# Altium schematic sheet DroneRegul.SchDoc
size A4
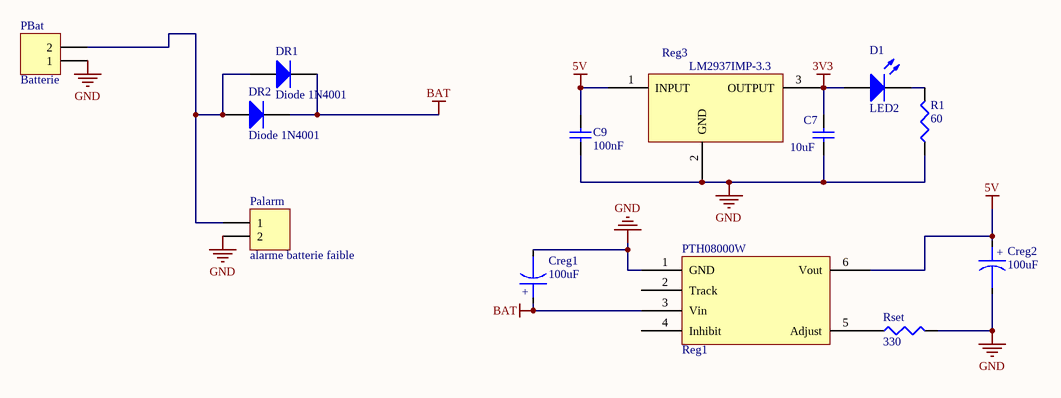
[diagram p0: DroneRegul.SchDoc]

## Parts
C7  value 10uF  [C0805C]  (hidden comment: CAP)
C9  value 100nF  [C0805C]  (hidden comment: CAP)
Creg1  value 100uF  [RB.1/.3]  (hidden comment: CAP Pol)
Creg2  value 100uF  [RB.1/.3]  (hidden comment: CAP Pol)
D1  LED2  [LED1206G]
DR1  Diode 1N4001  [DO-41]
DR2  Diode 1N4001  [DO-41]
Palarm  alarme batterie faible  [HDR1X2]
PBat  Batterie  [TERM2W-3.5]
PTH08000W  Reg1  [PTH08000W]
R1  value 60  [C0805R]  (hidden comment: RES)
Reg3  LM2937IMP-3.3  [TO-220-AB]
Rset  value 330  [C0805R]  (hidden comment: RES)

## Nets
3V3: C7.2 D1.1(A) Reg3.3(OUTPUT)
5V: C9.1 Creg2.1 PTH08000W.6(Vout) Reg3.1(INPUT)
BAT: Creg1.1 DR1.2(K) DR2.2(K) PTH08000W.3(Vin)
GND: C7.1 C9.2 Creg1.2 Creg2.2 Palarm.2 PBat.1 PTH08000W.1(GND) R1.1 Reg3.2(GND) Rset.2
NetD1_2: D1.2(K) R1.2
NetDR1_1: DR1.1(A) DR2.1(A) Palarm.1 PBat.2
NetPTH08000W_5: PTH08000W.5(Adjust) Rset.1

Not connected (* = marked no-connect by the designer): PTH08000W 2(Track) 4(Inhibit)

## Notes on the sheet
- (in symbol CAP Pol) +

## Library data of the parts
C7 C9 = CAP: Capacitor; Published: 8-Jun-2000; LatestRevisionDate: 29-May-2009; LatestRevisionNote: IPC-7351 Footprint Added.; PackageReference: C1206; Publisher: Altium Limited; PackageDescription: Chip Capacitor
Creg1 Creg2 = CAP Pol: Polarized Capacitor
D1 = LED2: Typical RED, GREEN, YELLOW, AMBER GaAs LED; Published: 8-Jun-2000; LatestRevisionDate: 17-Jul-2002; LatestRevisionNote: Re-released for DXP Platform.; PackageVersion: Feb-2002; PackageReference: 3.2X1.6X1.1; Publisher: Altium Limited; PackageDescription: SM LED; 2 Flat Leads
DR1 DR2 = Diode 1N4001: 1 Amp General Purpose Rectifier; Published: 8-Jun-2000; LatestRevisionDate: 17-Jul-2002; LatestRevisionNote: Re-released for DXP Platform.; DatasheetVersion: 1998; PackageVersion: Aug-1999; PackageReference: DO-41; Publisher: Altium Limited; PackageDescription: Diode, Axial; Body 5.2 x 2.7 mm (LxDia. max), Lead Dia. 0.86 mm (max); Code_JEDEC: DO-204-AL; ComponentLink1Description: Manufacturer Link; ComponentLink1URL: http://www.fairchildsemi.com/; ComponentLink2Description: Datasheet; ComponentLink2URL: http://www.fairchildsemi.com/ds/1N%2F1N4001.pdf
Palarm PBat = Header 2: Header, 2-Pin; LatestRevisionDate: 17-Jul-2002; LatestRevisionNote: Re-released for DXP Platform.; Publisher: Altium Limited
PTH08000W = PTH08000W
R1 Rset = RES: Resistor; Published: 8-Jun-2000; LatestRevisionDate: 29-May-2009; LatestRevisionNote: IPC-7351 Footprint Added.; PackageReference: J1-0603; Publisher: Altium Limited; PackageDescription: Chip Resistor
Reg3 = LM2937IMP-3.3: 500 mA Low Dropout Regulator